# EAGLE design X8-Backplane (EAGLE 7.7.0)
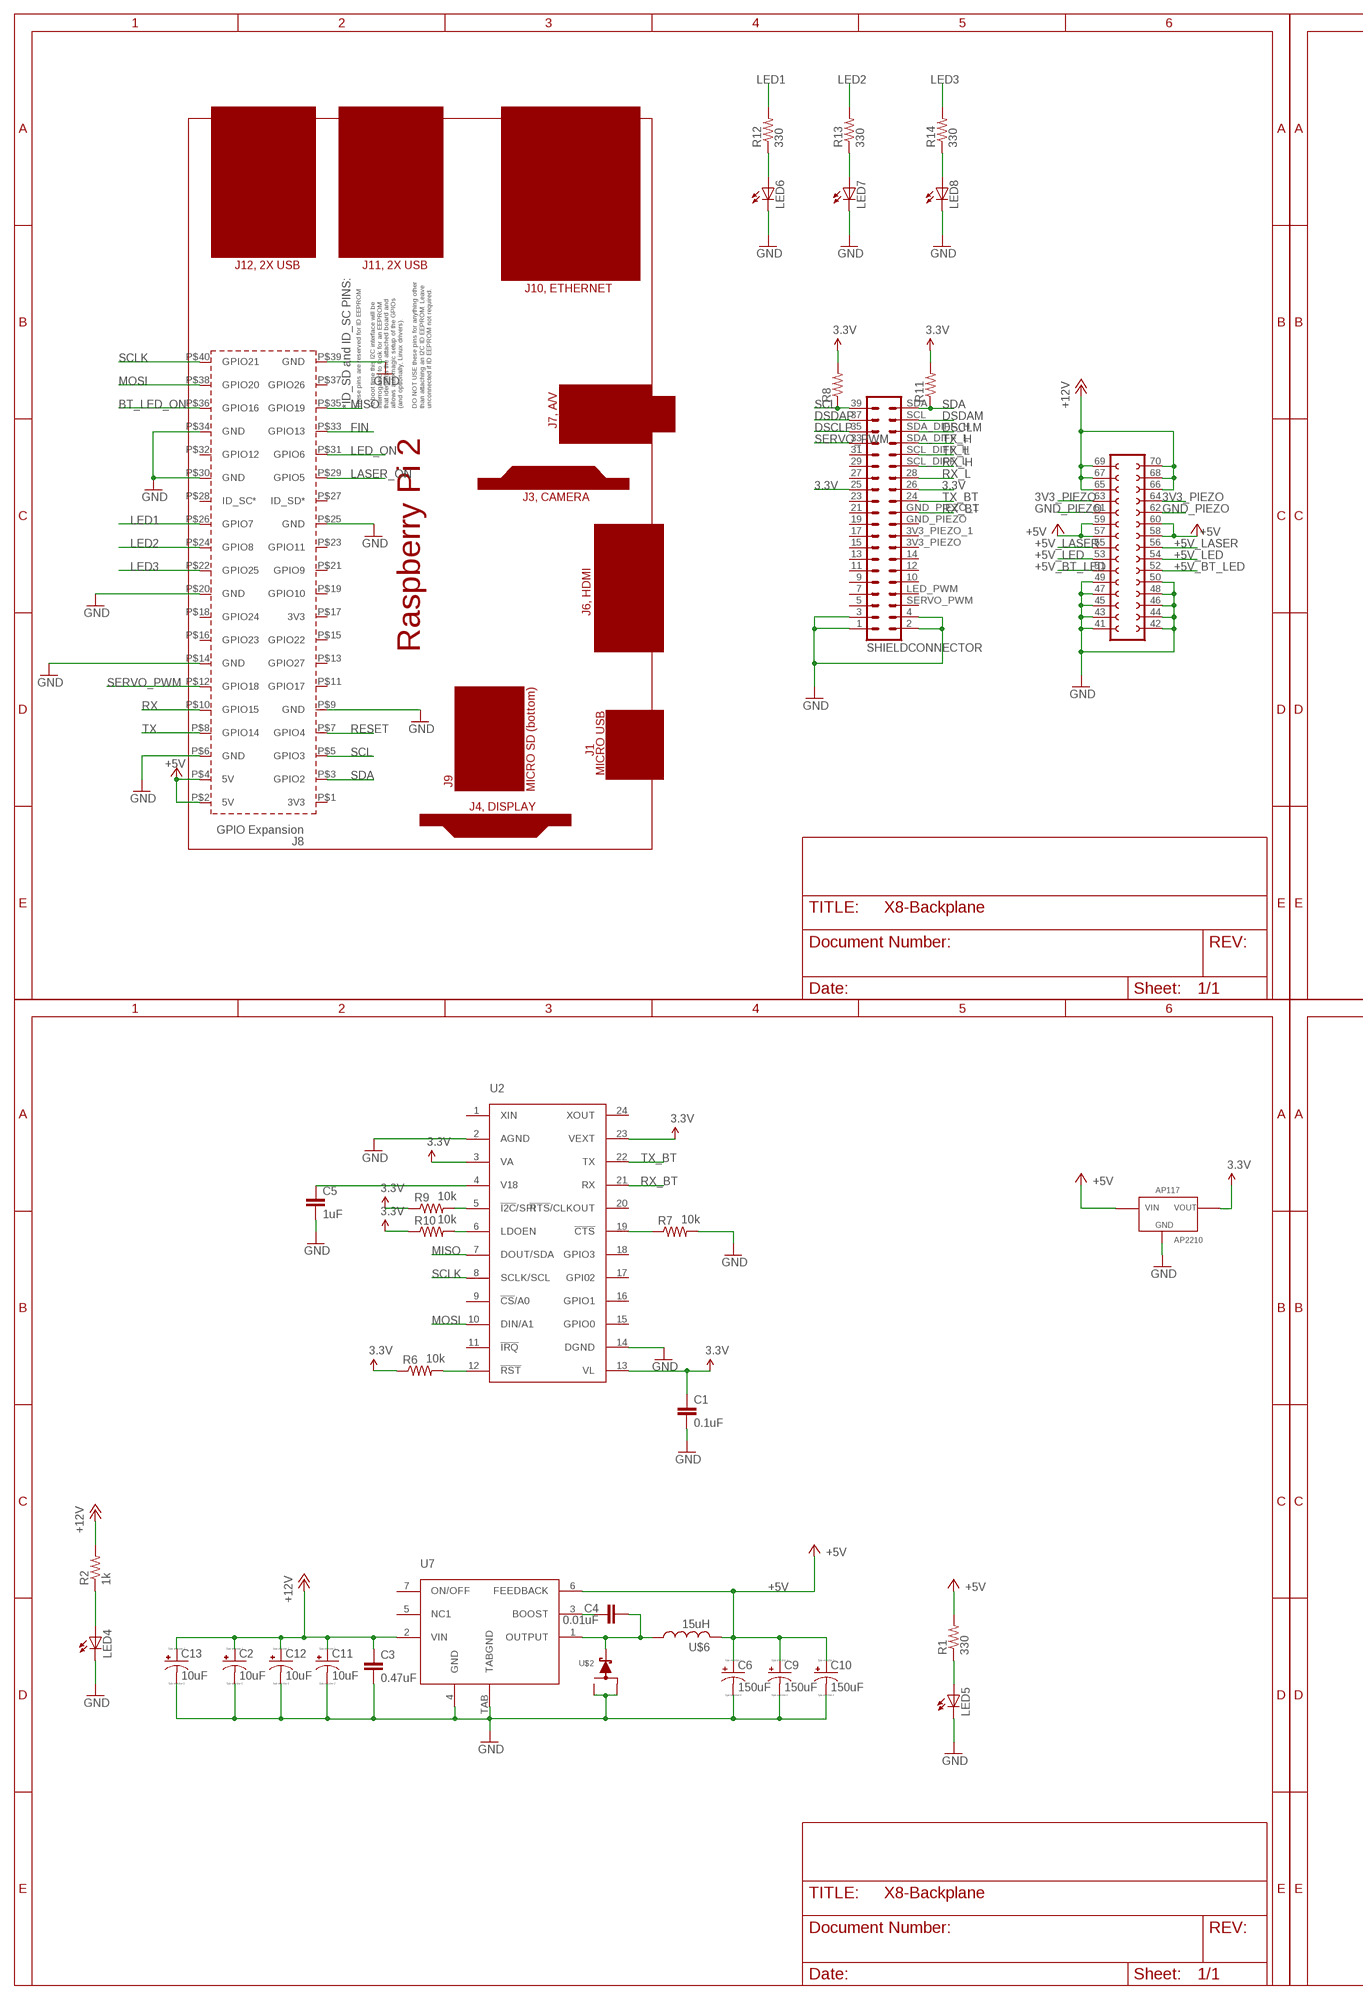
[diagram p0: schematic, sheet 1, part 1 of 2]
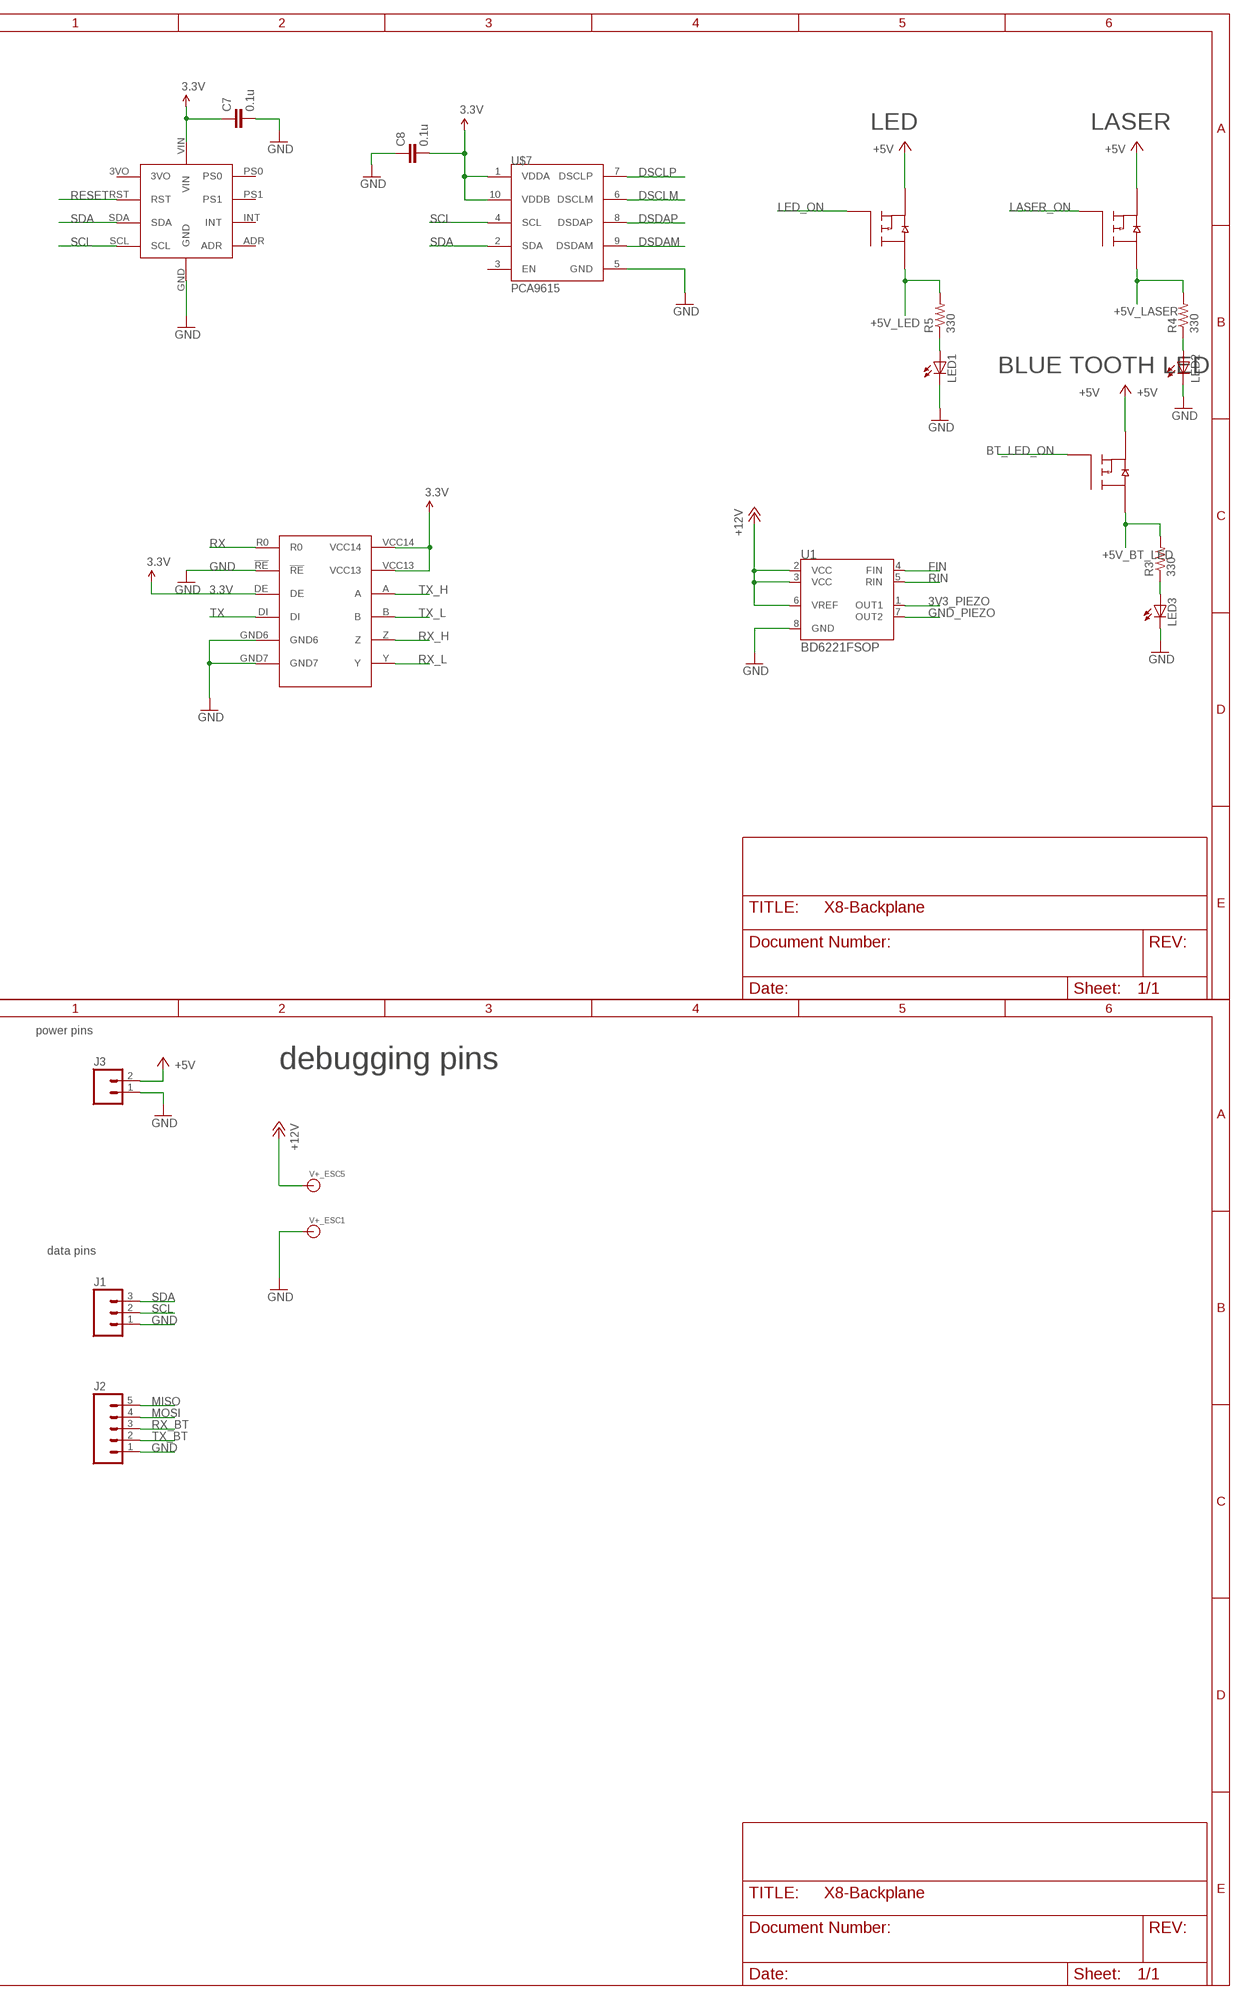
[diagram p1: schematic, sheet 1, part 2 of 2]

## Parts
C1  0.1uF  0.1UF-25V(+80/-20%)(0603)  [0603-CAP]
C2  10uF  C-TANTALUM(10UF_150UF)  [CTAN(7.30_4.30MM)]
C3  0.47uF  0.18UF-0603-10V-10%  [0603]
C4  0.01uF  CAP0603-CAP  [0603-CAP]
C5  1uF  0.1UF-25V(+80/-20%)(0603)  [0603-CAP]
C6  150uF  C-TANTALUM(10UF_150UF)  [CTAN(7.30_4.30MM)]
C7  0.1u  CAP0603-CAP  [0603-CAP]
C8  0.1u  CAP0603-CAP  [0603-CAP]
C9  150uF  C-TANTALUM(10UF_150UF)  [CTAN(7.30_4.30MM)]
C10  150uF  C-TANTALUM(10UF_150UF)  [CTAN(7.30_4.30MM)]
C11  10uF  C-TANTALUM(10UF_150UF)  [CTAN(7.30_4.30MM)]
C12  10uF  C-TANTALUM(10UF_150UF)  [CTAN(7.30_4.30MM)]
C13  10uF  C-TANTALUM(10UF_150UF)  [CTAN(7.30_4.30MM)]
J1  M03PTH  [1X03]
J2  M05PTH  [1X05]
J3  M02PTH  [1X02]
LED1  LEDSML0603  [SML0603]
LED2  LEDSML0603  [SML0603]
LED3  LEDSML0603  [SML0603]
LED4  LEDSML0603  [SML0603]
LED5  LEDSML0603  [SML0603]
LED6  LEDSML0603  [SML0603]
LED7  LEDSML0603  [SML0603]
LED8  LEDSML0603  [SML0603]
PCB1  RPI2  [RPI2]
R1  330  R-US_R0603  [R0603]
R2  1k  R-US_R0603  [R0603]
R3  330  R-US_R0603  [R0603]
R4  330  R-US_R0603  [R0603]
R5  330  R-US_R0603  [R0603]
R6  10k  RESISTOR0603-RES  [0603-RES]
R7  10k  RESISTOR0603-RES  [0603-RES]
R8  RESISTOR0603-RES  [0603-RES]
R9  10k  RESISTOR0603-RES  [0603-RES]
R10  10k  RESISTOR0603-RES  [0603-RES]
R11  RESISTOR0603-RES  [0603-RES]
R12  330  R-US_R0603  [R0603]
R13  330  R-US_R0603  [R0603]
R14  330  R-US_R0603  [R0603]
U1  BD6221FSOP  [SOP8]
U2  MAX3107SSOP  [SSOP-24]
U4  FQB27P06  [TO263-3]
U5  FQB27P06  [TO263-3]
U6  FQB27P06  [TO263-3]
U7  LM2678  [LM2678]
U$1  MAX3491  [MAX3491]
U$2  SWITCHMODE_SCHOTTKY  [DPAK-3]
U$3  BNO055_9DOF_BREAKOUT  [BNO055]
U$4  SHIELDCONNECTOR  [20X2PIN]
U$5  AP2210  [SOT-23-3]
U$6  15uH  HCMA1305  [HCMA1305]
U$7  PCA9615  [MSOP_10]
V+_ESC1  BANANA_CONN  [BANANA_CONN]
V+_ESC5  BANANA_CONN  [BANANA_CONN]

## Nets
3.3V: C1.1 C7.1 C8.2 R6.1 R8.2 R9.1 R10.1 R11.2 U2.3(VA) U2.13(VL) U2.23(VEXT) U$1.DE U$1.VCC13 U$1.VCC14 U$3.VIN U$4.25 U$4.26 U$5.VOUT U$7.1(VDDA) U$7.10(VDDB)
3V3_PIEZO: U1.1(OUT1) U$4.63 U$4.64
+5V: C6.+ C9.+ C10.+ J3.2 PCB1.P$2(5V) PCB1.P$4(5V) R1.2 U4.3(S2) U5.3(S2) U6.3(S2) U7.6(FEEDBACK) U$4.57 U$4.58 U$4.59 U$4.60 U$5.VIN U$6.P$2
+5V_BT_LED: R3.2 U6.TAB(D2) U$4.51 U$4.52
+5V_LASER: R4.2 U5.TAB(D2) U$4.55 U$4.56
+5V_LED: R5.2 U4.TAB(D2) U$4.53 U$4.54
+12V: C2.+ C3.1 C11.+ C12.+ C13.+ R2.2 U1.2(VCC) U1.3(VCC) U1.6(VREF) U7.2(VIN) U$4.65 U$4.66 U$4.67 U$4.68 U$4.69(12V) U$4.70 V+_ESC5.P$1
BT_LED_ON: PCB1.P$36(GPIO16) U6.1(G2)
DSCLM: U$4.SDA_DIFF_H U$7.6(DSCLM)
DSCLP: U$4.35 U$7.7(DSCLP)
DSDAM: U$4.SCL U$7.9(DSDAM)
DSDAP: U$4.37 U$7.8(DSDAP)
FIN: PCB1.P$33(GPIO13) U1.4(FIN)
GND: C1.2 C2.- C3.2 C5.2 C6.- C7.2 C8.1 C9.- C10.- C11.- C12.- C13.- J1.1 J2.1 J3.1 LED1.C LED2.C LED3.C LED4.C LED5.C LED6.C LED7.C LED8.C PCB1.P$6(GND) PCB1.P$9(GND) PCB1.P$14(GND) PCB1.P$20(GND) PCB1.P$25(GND) PCB1.P$30(GND) PCB1.P$34(GND) PCB1.P$39(GND) R7.2 U1.8(GND) U2.2(AGND) U2.14(DGND) U7.4(GND) U7.TAB(TABGND) U$1.!RE U$1.GND6 U$1.GND7 U$2.P$1 U$2.P$3 U$3.GND U$4.1 U$4.2 U$4.3 U$4.4 U$4.41 U$4.42 U$4.43 U$4.44 U$4.45 U$4.46 U$4.47 U$4.48 U$4.49 U$4.50 U$5.GND U$7.5(GND) V+_ESC1.P$1
GND_PIEZO: U1.7(OUT2) U$4.61 U$4.62
LASER_ON: PCB1.P$29(GPIO5) U5.1(G2)
LED1: PCB1.P$26(GPIO7) R12.2
LED2: PCB1.P$24(GPIO8) R13.2
LED3: PCB1.P$22(GPIO25) R14.2
LED_ON: PCB1.P$31(GPIO6) U4.1(G2)
MISO: J2.5 PCB1.P$35(GPIO19) U2.7(DOUT/SDA)
MOSI: J2.4 PCB1.P$38(GPIO20) U2.10(DIN/A1)
N$2: LED5.A R1.1
N$3: LED4.A R2.1
N$4: LED1.A R5.1
N$5: LED2.A R4.1
N$6: LED3.A R3.1
N$7: R6.2 U2.12(!RST!)
N$8: R7.1 U2.19(!CTS!)
N$9: C5.1 U2.4(V18)
N$10: R9.2 U2.5(!I2C!/SPI)
N$12: R10.2 U2.6(LDOEN)
N$13: LED6.A R12.1
N$14: LED7.A R13.1
N$15: LED8.A R14.1
N$18: C4.1 U7.3(BOOST)
N$19: C4.2 U7.1(OUTPUT) U$2.P$4 U$6.P$1
RESET: PCB1.P$7(GPIO4) U$3.RST
RIN: U1.5(RIN)
RX: PCB1.P$10(GPIO15) U$1.R0
RX_BT: J2.3 U2.21(RX) U$4.GND_PIEZO_1
RX_H: U$1.Z U$4.SCL_DIFF_L
RX_L: U$1.Y U$4.28
SCL: J1.2 PCB1.P$5(GPIO3) R8.1 U$3.SCL U$4.39 U$7.4(SCL)
SCLK: PCB1.P$40(GPIO21) U2.8(SCLK/SCL)
SDA: J1.3 PCB1.P$3(GPIO2) R11.1 U$3.SDA U$4.SDA U$7.2(SDA)
SERVO_PWM: PCB1.P$12(GPIO18) U$4.33
TX: PCB1.P$8(GPIO14) U$1.DI
TX_BT: J2.2 U2.22(TX) U$4.24
TX_H: U$1.A U$4.SDA_DIFF_L
TX_L: U$1.B U$4.SCL_DIFF_H
Unconnected: PCB1.P$1(3V3) PCB1.P$11(GPIO17) PCB1.P$13(GPIO27) PCB1.P$15(GPIO22) PCB1.P$16(GPIO23) PCB1.P$17(3V3) PCB1.P$18(GPIO24) PCB1.P$19(GPIO10) PCB1.P$21(GPIO9) PCB1.P$23(GPIO11) PCB1.P$27(ID_SD*) PCB1.P$28(ID_SC*) PCB1.P$32(GPIO12) PCB1.P$37(GPIO26) U2.1(XIN) U2.9(!CS!/A0) U2.11(!IRQ!) U2.15(GPIO0) U2.16(GPIO1) U2.17(GPI02) U2.18(GPIO3) U2.20(!RTS!/CLKOUT) U2.24(XOUT) U7.5(NC1) U7.7(ON/OFF) U$3.3VO U$3.ADR U$3.INT U$3.PS0 U$3.PS1 U$4.3V3_PIEZO U$4.3V3_PIEZO_1 U$4.5 U$4.7 U$4.9 U$4.10 U$4.11 U$4.12 U$4.13 U$4.14 U$4.15 U$4.17 U$4.19 U$4.21 U$4.23 U$4.27 U$4.29 U$4.31 U$4.GND_PIEZO U$4.LED_PWM U$4.SERVO_PWM U$7.3(EN)

## Notes on the sheet
- LED | LASER
- BLUE TOOTH LED
- power pins
- debugging pins
- data pins

## Library data of the parts
C1 = SparkFun-Capacitors:0.1UF-25V(+80/-20%)(0603): CAP-00810 Ceramic Standard decoupling cap; PROD_ID: CAP-00810
C2 C6 C9-C13 = PowerComponents:C-TANTALUM(10UF_150UF)
C3 = SparkFun-Capacitors:0.18UF: 0.18µF ceramic capacitor A capacitor is a passive two-terminal electrical component used to store electrical energy temporarily in an electric field.; PROD_ID: CAP-12380; VALUE: 0.18uF
C4 C7 C8 = SparkFun-Passives:CAP: Capacitor Standard 0603 ceramic capacitor, and 0.1" leaded capacitor.
C5 = SparkFun-Capacitors:0.1UF-25V(+80/-20%)(0603): CAP-00810 Ceramic Standard decoupling cap; PROD_ID: CAP-00810; VALUE: 0.1uF
J1 = SparkFun-Connectors:M03: Header 3 Standard 3-pin 0.1" header. Use with straight break away headers (SKU : PRT-00116), right angle break away headers (PRT-00553), swiss pins (PRT-00743), machine pins (PRT-00117), and female headers (PRT-00115). Molex polarized connector foot print use with SKU : PRT-08232 with associated crimp pins and housings.
J2 = SparkFun-Connectors:M05: Header 5 Standard 5-pin 0.1" header. Use with straight break away headers (SKU : PRT-00116), right angle break away headers (PRT-00553), swiss pins (PRT-00743), machine pins (PRT-00117), and female headers (PRT-00115). Molex polarized connector foot print use with SKU : PRT-08230 with associated crimp pins and housings.
J3 = SparkFun-Connectors:M02: Standard 2-pin 0.1" header. Use with - straight break away headers ( PRT-00116) - right angle break away headers (PRT-00553) - swiss pins (PRT-00743) - machine pins (PRT-00117) - female headers (PRT-00115) Molex polarized connector foot print use with: PRT-08233 with associated crimp pins and housings. 2.54_SCREWTERM for use with PRT-10571. 3.5mm Screw Terminal footprints for PRT-08084 5mm Screw Terminal footprints for use with PRT-08432
LED1-LED8 = led:LED: LED OSRAM: - CHIPLED LG R971, LG N971, LY N971, LG Q971, LY Q971, LO R971, LY R971 LH N974, LH R974 LS Q976, LO Q976, LY Q976 LO Q996 - Hyper CHIPLED LW Q18S LB Q993, LB Q99A, LB R99A - SideLED LS A670, LO A670, LY A670, LG A670, LP A670 LB A673, LV A673, LT A673, LW A673 LH A674 LY A675 LS A676, LA A676, LO A676, LY A676, LW A676 LS A679, LY A679, LG A679 - Hyper Micro SIDELED® LS Y876, LA Y876, LO Y876, LY Y876 LT Y87S - SmartLED LW L88C, LW L88S LB L89C, LB L89S, LG L890 LS L89K, LO L89K, LY L89K LS L896, LA L896, LO L896, LY L896 - TOPLED LS T670, LO T670, LY T670, LG T670, LP T670 LSG T670, LSP T670, LSY T670, LOP T670, LYG T670 LG T671, LOG T671, LSG T671 LB T673, LV T673, LT T673, LW T673 LH T674 LS T676, LA T676, LO T676, LY T676, LB T676, LH T676, LSB T676, LW T676 LB T67C, LV T67C, LT T67C, LS T67K, LO T67K, LY T67K, LW E67C LS E67B, LA E67B, LO E67B, LY E67B, LB E67C, LV E67C, LT E67C LW T67C LS T679, LY T679, LG T679 LS T770, LO T770, LY T770, LG T770, LP T770 LB T773, LV T773, LT T773, LW T773 LH T774 LS E675, LA E675, LY E675, LS T675 LS T776, LA T776, LO T776, LY T776, LB T776 LHGB T686 LT T68C, LB T68C - Hyper Mini TOPLED® LB M676 - Mini TOPLED Santana® LG M470 LS M47K, LO M47K, LY M47K Source: http://www.osram.convergy.de LUXEON: - LUMILED® LXK2-PW12-R00, LXK2-PW12-S00, LXK2-PW14-U00, LXK2-PW14-V00 LXK2-PM12-R00, LXK2-PM12-S00, LXK2-PM14-U00 LXK2-PE12-Q00, LXK2-PE12-R00, LXK2-PE12-S00, LXK2-PE14-T00, LXK2-PE14-U00 LXK2-PB12-K00, LXK2-PB12-L00, LXK2-PB12-M00, LXK2-PB14-N00, LXK2-PB14-P00, LXK2-PB14-Q00 LXK2-PR12-L00, LXK2-PR12-M00, LXK2-PR14-Q00, LXK2-PR14-R00 LXK2-PD12-Q00, LXK2-PD12-R00, LXK2-PD12-S00 LXK2-PH12-R00, LXK2-PH12-S00 LXK2-PL12-P00, LXK2-PL12-Q00, LXK2-PL12-R00 Source: www.luxeon.com KINGBRIGHT: KA-3528ASYC Source: www.kingbright.com
PCB1 = MicrocontrollerComponents:RPI2: Device for Raspberry Pi 2 board created by www.element14.com More information and support community is available at http://www.element14.com/community/community/raspberry-pi/raspberrypi2
R1-R5 R12-R14 = resistor:R-US_: RESISTOR, American symbol
R6-R11 = SparkFun-Passives:RESISTOR: Resistor Basic schematic elements and footprints for 0603, 1206, and PTH resistors.
U1 = CamSensComponents:BD6221F: H-bridge driver (full bridge driver) for brush motor applications
U2 = BackplaneParts:MAX3107: MAX3107 SPI/I2C UART with 128-Word FIFOs Digi-Key part: http://www.digikey.com/product-detail/en/maxim-integrated/MAX3107EAG-/MAX3107EAG--ND/2238939
U4-U6 = CamSensComponents:FQB27P06
U7 = PowerComponents:LM2678: LM2678 Buck Converter IC 12V-to-5V
U$1 = BackplaneParts:MAX3491
U$2 = PowerComponents:SWITCHMODE_SCHOTTKY: {Digi-Key Part Number: MBRD835LT4GOSCT-ND} {Voltage - DC Reverse (Vr) (Max): 35V} {Current - Average Rectified (Io): 8A} {Voltage - Forward (Vf) (Max) @ If: 510mV @ 8A} {Speed: Fast Recovery =< 500ns, > 200mA (Io)} {Current - Reverse Leakage @ Vr: 1.4mA @ 35V} {Mounting Type: Surface Mount} {Package / Case: TO-252-3, DPak (2 Leads + Tab), SC-63} {Supplier Device Package: DPAK-3} {Operating Temperature - Junction: -65°C ~ 150°C}
U$3 = Other:BNO055_9DOF_BREAKOUT
U$4 = backplane_to_shield_connector:SHIELDCONNECTOR
U$5 = PowerComponents:AP2210
U$6 = DiscreteComponents:HCMA1305
U$7 = test_lib:PCA9615
V+_ESC1 V+_ESC5 = SparkFun-Connectors:BANANA_CONN: Through-hole banana jack

## Board
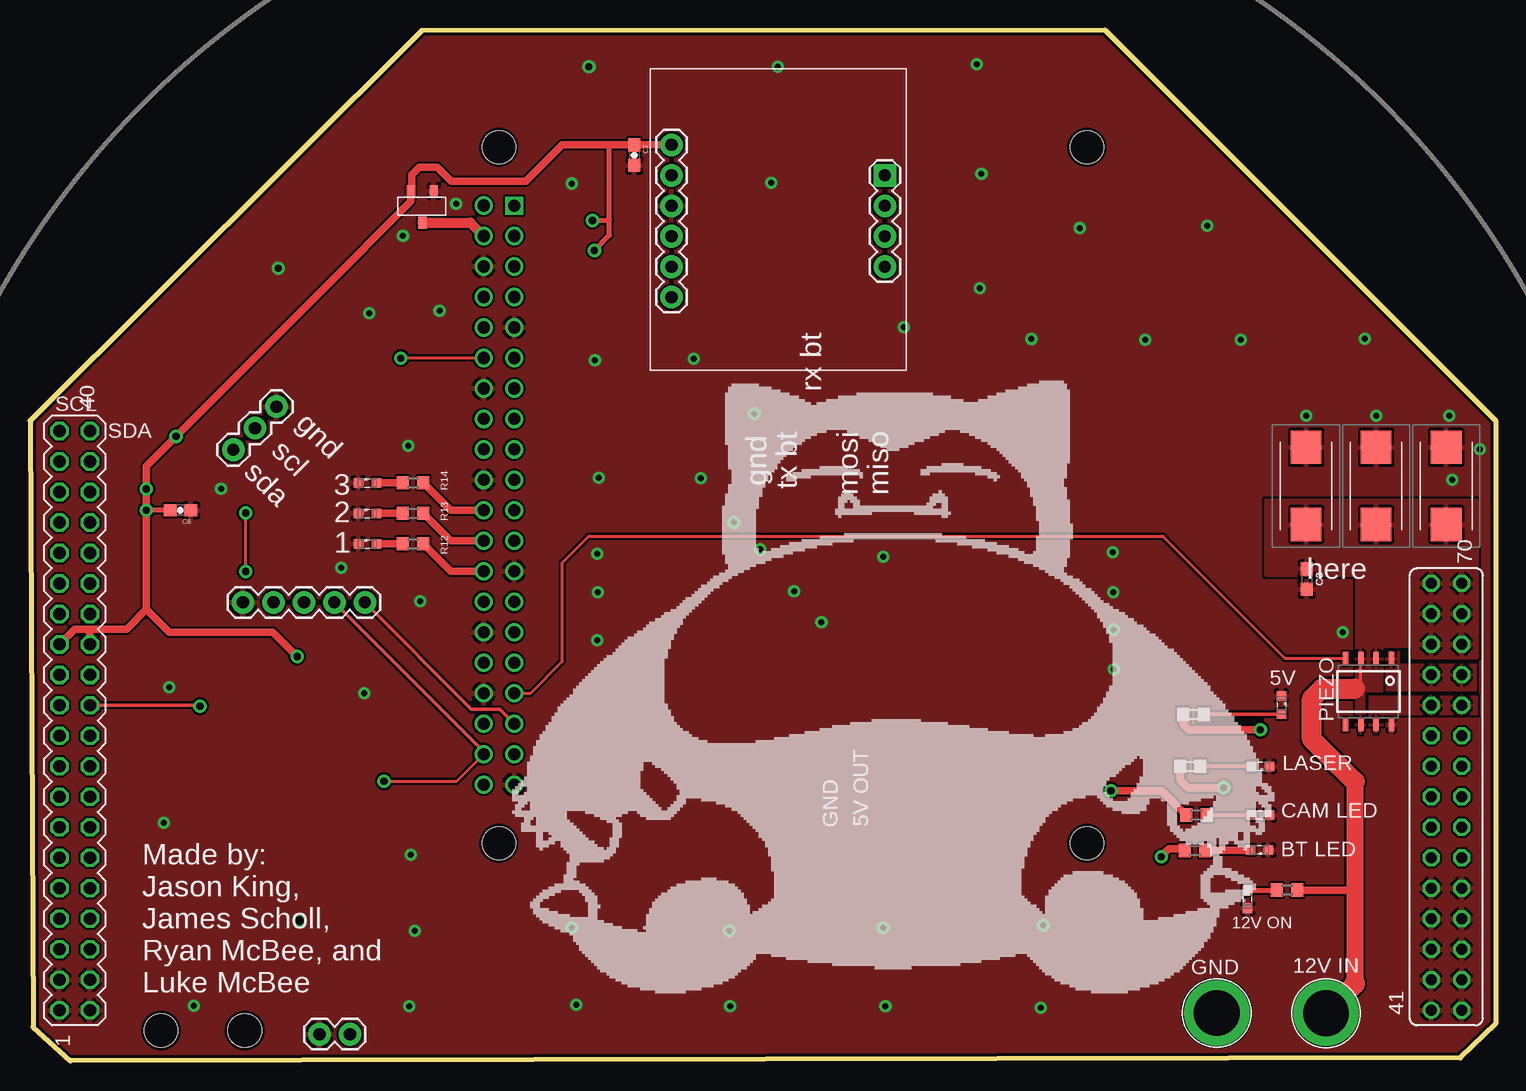
[diagram p2: board, top side]
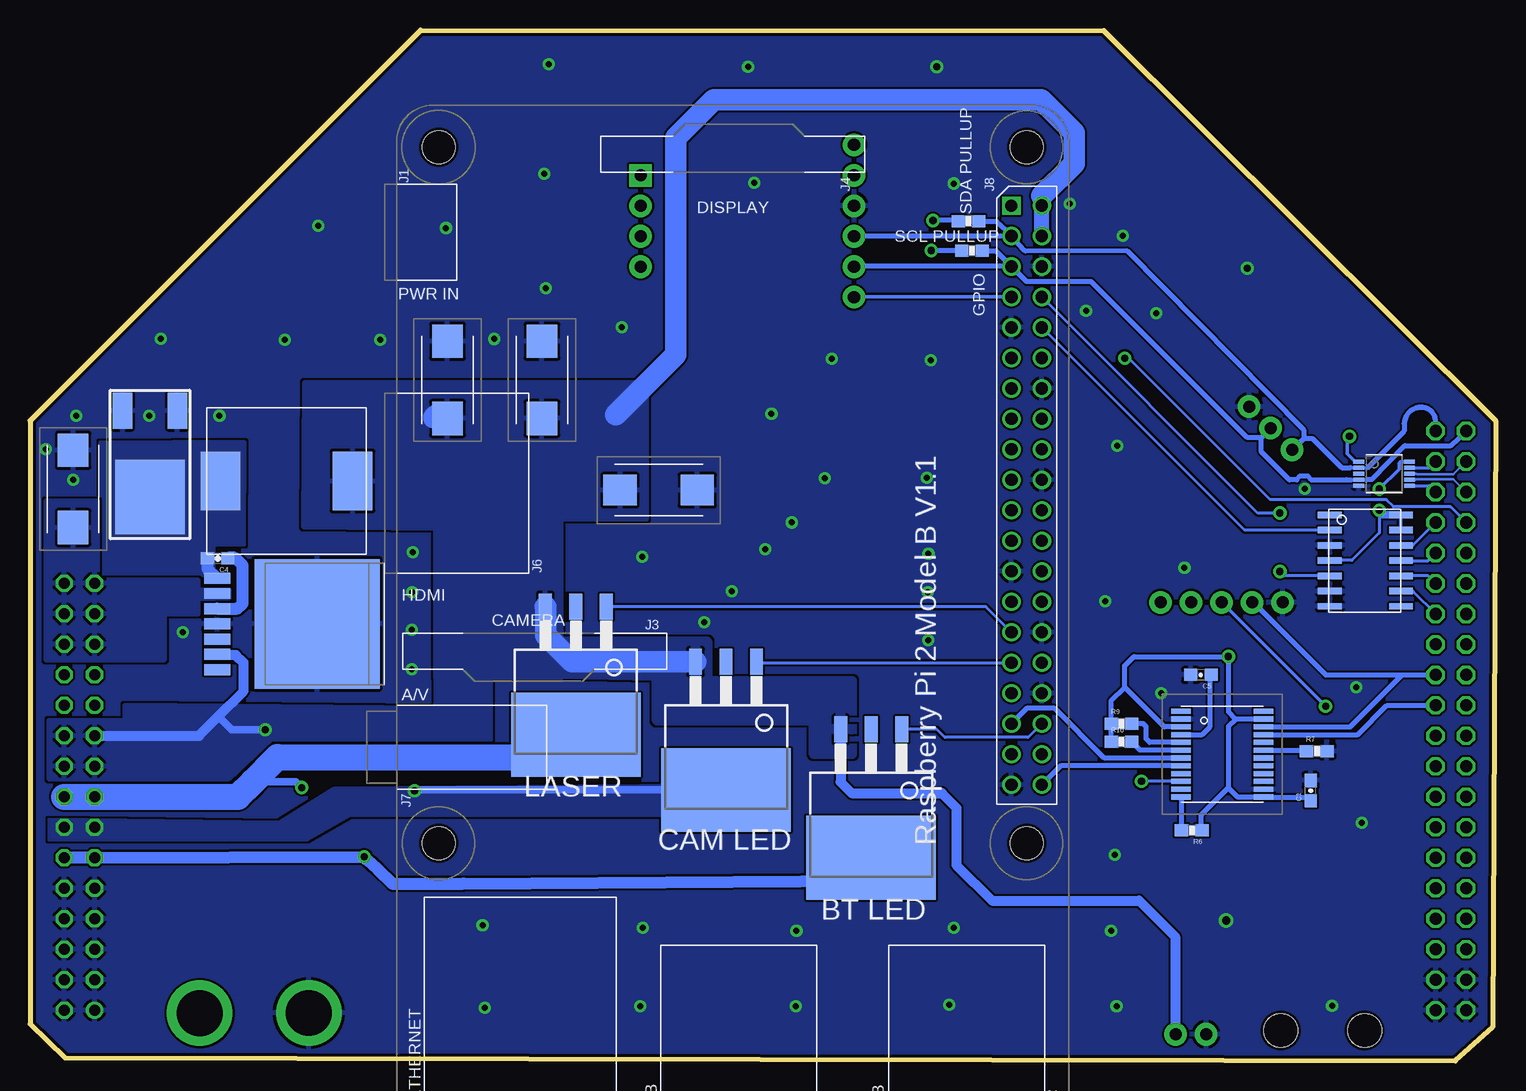
[diagram p3: board, bottom side, seen from below]

Size 122.13 x 85.9 mm. Coordinates in mm from the lower left corner, seen from the top.
Outline: 32.64,85.85 0,53.36 0.25,2.82 3.36,0 119.21,0.25 122.13,3.07 122.13,53.36 89.59,85.9 32.64,85.85
Copper layers (1*16): Top 0.035mm / dielectric 1.5mm / Bottom 0.035mm
Design rules "GoldPhoenix": minimum track width 7mil, minimum drill 10mil, track to track 7mil, track to pad 7mil, pad to pad 7mil, via to via 7mil, smd to smd 7mil, copper to edge 10mil, drill to drill 8mil, minimum pad ring 10mil, minimum via ring 10mil, stop-mask expansion 4mil, vias tented up to drill 25mil, thermal gap 10mil
Holes 2.8 mm at 17.9,2.52 10.91,2.52

### Footprints (pad centres in the part's own frame; a part is rotated, then mirrored left to right if it is on the bottom)
0603-CAP = smd 1.1 x 1: 1 -0.85,0; 2 0.85,0
CTAN(7.30_4.30MM) = smd 2.77 x 2.55: + -3.22,0; - 3.22,0
0603 = smd 1.1 x 1: 1 -0.85,0; 2 0.85,0
1X03 = drill 1.016 pad 1.88: 1 0,0; 2 2.54,0; 3 5.08,0
1X05 = drill 1.016 pad 1.88: 1 0,0; 2 2.54,0; 3 5.08,0; 4 7.62,0; 5 10.16,0
1X02 = drill 1.016 pad 1.88: 1 0,0; 2 2.54,0
SML0603 = smd 0.8 x 0.8: A 0.75,0; C -0.75,0
RPI2 = drill 1.016 square: P$1 8.37,51.23 | drill 1.016: P$2 8.357,53.772; P$3 10.897,51.232; P$4 10.897,53.772; P$5 13.437,51.232; P$6 13.437,53.772; P$7 15.977,51.232; P$8 15.977,53.772; P$9 18.517,51.232; P$10 18.517,53.772; P$11 21.057,51.232; P$12 21.057,53.772; P$13 23.597,51.232; P$14 23.597,53.772; P$15 26.137,51.232; P$16 26.137,53.772; P$17 28.677,51.232; P$18 28.677,53.772; P$19 31.217,51.232; P$20 31.217,53.772; P$21 33.757,51.232; P$22 33.757,53.772; P$23 36.297,51.232; P$24 36.297,53.772; P$25 38.837,51.232; P$26 38.837,53.772; P$27 41.377,51.232; P$28 41.377,53.772; P$29 43.917,51.232; P$30 43.917,53.772; P$31 46.457,51.232; P$32 46.457,53.772; P$33 48.997,51.232; P$34 48.997,53.772; P$35 51.537,51.232; P$36 51.537,53.772; P$37 54.077,51.232; P$38 54.077,53.772; P$39 56.617,51.232; P$40 56.617,53.772 | hole 2.75: 3.5,3.5; 61.5,3.5; 3.5,52.5; 61.5,52.5
R0603 = smd 1 x 1.1: 1 -0.85,0; 2 0.85,0
0603-RES = smd 1.1 x 1: 1 -0.85,0; 2 0.85,0
SOP8 = smd 0.462 x 1.1: 1 0.595,-0.55; 2 1.865,-0.55; 3 3.135,-0.55; 4 4.405,-0.55; 5 4.405,4.95; 6 3.135,4.95; 7 1.865,4.95; 8 0.595,4.95
SSOP-24 = smd 1.62 x 0.42: 1 -3.425,3.575; 2 -3.425,2.925; 3 -3.425,2.275; 4 -3.425,1.625; 5 -3.425,0.975; 6 -3.425,0.325; 7 -3.425,-0.325; 8 -3.425,-0.975; 9 -3.425,-1.625; 10 -3.425,-2.275; 11 -3.425,-2.925; 12 -3.425,-3.575; 13 3.425,-3.575; 14 3.425,-2.925; 15 3.425,-2.275; 16 3.425,-1.625; 17 3.425,-0.975; 18 3.425,-0.325; 19 3.425,0.325; 20 3.425,0.975; 21 3.425,1.625; 22 3.425,2.275; 23 3.425,2.925; 24 3.425,3.575
TO263-3 = smd 1.067 x 2.159: 1 -2.54,-5.08; 2 0,-5.08; 3 2.54,-5.08 | smd 10.795 x 6.985: TAB 0,5.601
LM2678 = smd 2.159 x 0.914: 1 8.331,-3.81; 2 8.331,-2.54; 3 8.331,-1.27; 4 8.331,0; 5 8.331,1.27; 6 8.331,2.54; 7 8.331,3.81 | smd 10.414 x 10.795: TAB 0,0
MAX3491 = smd 1.981 x 0.533: !RE 0,5.08; A 5.918,5.08; B 5.918,3.81; DE 0,3.81; DI 0,2.54; GND6 0,1.27; GND7 0,0; NC1 0,7.62; NC8 5.918,0; R0 0,6.35; VCC13 5.918,6.35; VCC14 5.918,7.62; Y 5.918,1.27; Z 5.918,2.54
DPAK-3 = smd 3 x 1.6: P$1 4.08,-2.285; P$3 4.08,2.285 | smd 6.2 x 5.8: P$4 -3.1,0
BNO055 = drill 1.016 pad 1.88: 3VO -8.89,2.54; ADR 8.89,-5.08; GND -8.89,0; INT 8.89,-2.54; PS1 8.89,0; RST -8.89,-7.62; SCL -8.89,-5.08; SDA -8.89,-2.54; VIN -8.89,5.08 | drill 1.016 pad 1.88 square: PS0 8.89,2.54
20X2PIN = drill 1.016 octagon: 1 -55.88,-26.67; 2 -53.34,-26.67; 3 -55.88,-24.13; 3V3_PIEZO -53.34,-8.89; 3V3_PIEZO_1 -53.34,-6.35; 4 -53.34,-24.13; 5 -55.88,-21.59; 7 -55.88,-19.05; 9 -55.88,-16.51; 10 -53.34,-16.51; 11 -55.88,-13.97; 12 -53.34,-13.97; 13 -55.88,-11.43; 14 -53.34,-11.43; 15 -55.88,-8.89; 17 -55.88,-6.35; 19 -55.88,-3.81; 21 -55.88,-1.27; 23 -55.88,1.27; 24 -53.34,1.27; 25 -55.88,3.81; 26 -53.34,3.81; 27 -55.88,6.35; 28 -53.34,6.35; 29 -55.88,8.89; 31 -55.88,11.43; 33 -55.88,13.97; 35 -55.88,16.51; 37 -55.88,19.05; 39 -55.88,21.59; GND_PIEZO -53.34,-3.81; GND_PIEZO_1 -53.34,-1.27; LED_PWM -53.34,-19.05; SCL -53.34,19.05; SCL_DIFF_H -53.34,11.43; SCL_DIFF_L -53.34,8.89; SDA -53.34,21.59; SDA_DIFF_H -53.34,16.51; SDA_DIFF_L -53.34,13.97; SERVO_PWM -53.34,-21.59 | drill 0.914: 41 58.42,-26.67 | drill 0.914 octagon: 42 60.96,-26.67; 43 58.42,-24.13; 44 60.96,-24.13; 45 58.42,-21.59; 46 60.96,-21.59; 47 58.42,-19.05; 48 60.96,-19.05; 49 58.42,-16.51; 50 60.96,-16.51; 51 58.42,-13.97; 52 60.96,-13.97; 53 58.42,-11.43; 54 60.96,-11.43; 55 58.42,-8.89; 56 60.96,-8.89; 57 58.42,-6.35; 58 60.96,-6.35; 59 58.42,-3.81; 60 60.96,-3.81; 61 58.42,-1.27; 62 60.96,-1.27; 63 58.42,1.27; 64 60.96,1.27; 65 58.42,3.81; 66 60.96,3.81; 67 58.42,6.35; 68 60.96,6.35; 69 58.42,8.89; 70 60.96,8.89
SOT-23-3 = smd 0.7 x 1: GND 0,0; VIN 0.95,2.6; VOUT 1.9,0
HCMA1305 = smd 4.9 x 3.3: P$1 0,5.5; P$2 0,-5.5
MSOP_10 = smd 0.305 x 0.889: 1 -1,-2.11; 2 -0.5,-2.11; 3 0,-2.11; 4 0.5,-2.11; 5 1,-2.11; 6 1,2.11; 7 0.5,2.11; 8 0,2.11; 9 -0.5,2.11; 10 -1,2.11
BANANA_CONN = drill 3.81 pad 5.461: P$1 0,0

### Placement (x,y rotation side)
C1  15.41,22.51 90 bottom
C2  118.53,47.66 90 bottom
C3  106.39,40.14 270 top
C4  106.49,41.87 180 bottom
C5  24.55,32.16 180 bottom
C6  87.34,56.75 90 bottom
C7  50.36,75.47 270 top
C8  12.54,45.88 180 top
C9  69.74,47.56 0 bottom
C10  79.47,56.75 90 bottom
C11  112.18,47.91 90 top
C12  118.02,47.91 90 top
C13  106.34,47.91 90 top
J1  20.54,54.52 225 top
J2  17.75,38.21 0 top
J3  24.12,2.22 0 top
LED1  102.53,20.48 180 top
LED2  102.53,24.54 180 top
LED3  102.45,17.56 180 top
LED4  101.46,13.47 90 top
LED5  104.28,29.65 270 top
LED6  28.11,43.09 0 top
LED7  28.11,45.63 0 top
LED8  28.11,48.17 0 top
PCB1  91.58,79.63 270 bottom
R1  96.94,28.86 180 top
R2  104.77,14.23 0 top
R3  97.1,17.53 180 top
R4  96.69,24.54 180 top
R5  97.2,20.48 180 top
R6  25.31,19.21 180 bottom
R7  14.9,25.81 0 bottom
R8  43.63,67.5 180 bottom
R9  31.16,28.1 0 bottom
R10  31.16,26.58 0 bottom
R11  43.91,69.98 180 bottom
R12  31.92,43.09 0 top
R13  31.92,45.63 0 top
R14  31.92,48.17 0 top
U1  114.04,32.98 180 top
U2  22.77,25.56 0 bottom
U4  64.13,28.18 180 bottom
U5  76.65,32.77 180 bottom
U6  52.04,22.54 180 bottom
U7  98.21,36.41 180 bottom
U$1  13.81,37.88 0 bottom
U$2  112.13,50.1 90 bottom
U$3  62.35,71.25 0 top
U$4  58.33,30.89 0 top
U$5  33.65,72.45 180 top
U$6  100.75,48.32 90 bottom
U$7  9.29,48.93 270 bottom
V+_ESC1  98.9,4 0 top
V+_ESC5  107.99,3.97 90 top

### Tracks (layer width: path | path; a pad name or v marks a point on that pad's centre or on a via)
3.3V  (via drill 0.6, 0.6 pad 0.3)
  Top 0.305: 27.09,66.96 27.85,67.72 | 29.16,69.03 28.12,67.99
  Top 0.406: v47.03,67.52 48.28,68.79 48.28,70.04 | 48.28,70.04 48.28,76.34 | v46.88,70.04 48.28,70.04 | C8.2 v9.69,45.88
  Top 0.61: 9.69,37.63 v9.69,45.88 v9.69,47.66 9.69,49.56 v12.17,52.04 27.85,67.72 28.12,67.99 31.75,71.62 U$5.VOUT 31.79,72.49 31.79,73.82 32.43,74.46 33.95,74.46 35.09,73.31 41.32,73.31 44.34,76.34 48.28,76.34 50.35,76.34 | 9.69,37.63 8.04,35.97 5.15,35.97 | 5.15,35.97 3.72,35.97 U$4.25 | 9.69,37.63 11.6,35.72 20.23,35.72 v22.27,33.69 | U$4.26 4.99,35.82 5.15,35.97 | 50.35,76.34 C7.1 | 50.35,76.34 U$3.VIN
  Bottom 0.254: 9.69,45.75 9.69,44 11.98,41.71 13.78,41.71 U$1.DE
  Bottom 0.305: U$7.1 11.71,49.93 12.36,50.58 12.36,51.85 v12.17,52.04 | U$1.VCC13 U$1.VCC14 | U$7.10 7.93,49.93 8.04,49.82 8.04,49.31 v9.69,47.66 | R11.2 44.66,70.04
  Bottom 0.406: U2.13 15.73,21.99 C1.1 | U2.13 19.24,21.99 19.22,22 | R10.1 R9.1 32.01,30.04 30.9,31.15 | 22.27,22.77 22.27,27.85 21.63,28.49 U2.23 21.64,28.49 22.27,29.12 v22.27,33.69 30.14,33.69 30.9,32.93 30.9,31.15 | U2.13 21.49,21.99 22.27,22.77 | 22.27,22.77 24.55,20.48 24.55,19.3 R6.1 | U2.3 27.59,27.84 30.9,31.15 | R8.2 v47.03,67.52 | 44.66,70.04 v46.88,70.04
  Bottom 0.61: v9.69,45.88 9.69,45.75 9.44,45.5 U$1.VCC14
3V3_PIEZO
  pour Top: 113.1,34.07 114.04,34.07 114.04,33.03 120.44,33.03 120.44,30.89 113.1,30.89
+5V  (via drill 0.6)
  Top 0.61: v102.53,27.59 96.54,27.59 96.09,28.04 R1.2
  Top 0.813: U$5.VIN 36.69,69.85 PCB1.P$4
  Bottom 0.61: v102.53,27.59 105.32,27.59 106.44,28.71
  Bottom 0.813: U$4.59 108.07,27.08 106.44,28.71 104.33,30.82 104.33,33.18 104.97,33.82 106.49,33.82 U7.6 | U6.3 54.58,23.22 53.66,22.31 46.14,22.31 44.92,21.09 44.92,16.31 41.95,13.34 29.71,13.34 26.71,10.35 26.71,2.27 J3.2
  Bottom 1.27: PCB1.P$4 PCB1.P$2
  Bottom 1.422: PCB1.P$2 37.81,72.07
  Bottom 1.778: 88.23,53.84 88.48,53.58 | U4.3 76.95,33.26 79.16,35.47 79.16,37.83 U5.3 | 37.81,72.07 35.12,74.76 35.12,77.35 37.86,80.09 65.17,80.09 68.32,76.94 68.32,58.84 73.32,53.84
  pour Bottom: 53.64,31.66 53.64,25.56 56.81,25.56 56.81,28.35 69.89,28.35 69.89,32.04 81.96,32.29 81.91,34.96 65.7,34.96 65.7,31.66
  pour Bottom: 120.56,23.53 105.58,23.53 102.02,26.83 83.73,26.83 83.73,35.21 88.31,35.21 88.31,29.37 114.21,29.62 114.21,28.35 120.56,28.35
  pour Bottom: 70.78,56.55 70.78,45.12 77.89,45.12 77.89,31.91 88.31,31.91 88.31,44.36 99.31,44.48 99.23,56.55
+5V_BT_LED  (via drill 0.6)
  Top 0.61: v94.28,17 arc-45 94.31,17.09 94.91,17.69 95.99,17.69 arc-45 96.17,17.61 R3.2
  Bottom 0.254: v94.28,17 94.19,17 94.19,16.9
  Bottom 0.61: 92.04,14.89 91.89,14.74
  Bottom 1.016: U$4.52 U$4.51 94.33,17.03 94.19,16.9 94.02,16.75 93.21,16.02 91.89,14.74 86.02,14.78 52.29,14.99 U6.TAB
+5V_LASER  (via drill 0.6)
  Top 0.61: v99.48,22.77 96.46,22.77 95.85,23.38 95.85,24.53 R4.2
  Bottom 0.61: v99.48,22.77 99.99,23.27 103.55,23.27
  Bottom 2.184: U$4.56 U$4.55 104.82,22 103.55,23.27 101.51,25.31 77.38,25.31 75.86,26.83 76.31,26.83 U5.TAB
+5V_LED  (via drill 0.6)
  Top 0.61: R5.2 94.31,22.51 v90.08,22.51
  Bottom 0.61: v90.08,22.51 90.02,22.58 U4.TAB
  pour Bottom (no thermals): 120.51,20.18 101.34,19.92 96.77,22.74 66.23,22.99 66.23,20.43 95.5,20.43 99.05,18.37 120.51,18.37
+12V
  Top 0.254: 110.4,31.02 110.4,31.3 110.89,31.78 110.89,33.51 U1.3
  Top 0.61: R2.2 110.2,14.23 arc-45 110.38,14.16
  Top 1.422: 110.4,23.27 110.38,23.27 110.38,14.16 110.4,14.16 110.4,6.49
  Top 1.676: 110.4,31.02 107.66,31.02 106.82,30.18 106.82,26.81 109.03,24.6 arc-45 109.12,24.56 110.4,23.27 | 110.4,6.49 arc-45 110.33,6.31 V+_ESC5.P$1
  pour Top (rank 2): 111.17,30.84 112.69,30.84 112.69,34.55 115.51,34.55 115.51,33.87 120.49,33.87 120.49,40.77 110.51,40.77 110.51,27.34 111.17,27.34
  pour Bottom (rank 2): 120.82,33.43 110.91,33.43 110.91,37.24 108.12,37.24 108.12,40.04 116.5,40.04 116.5,46.64 120.82,46.64
  pour Bottom (no thermals): 105.58,39.28 105.58,38.51 110.15,38.51 110.15,39.28
  pour Top: 103.04,46.64 103.04,40.55 115.23,40.55 115.23,33.69 120.56,33.69 120.56,46.64
BT_LED_ON
  Bottom 0.254: PCB1.P$36 38.94,26.96 45.89,26.96 46.55,27.62 U6.1
DSCLM
  Bottom 0.254: U$7.6 5.52,47.93 U$4.SDA_DIFF_H
DSCLP
  Bottom 0.229: 6.69,48.43 6.62,48.47 3.55,48.47 U$4.35
  Bottom 0.254: U$7.7 6.69,48.43
DSDAM
  Bottom 0.254: U$7.9 5.51,49.43 U$4.SCL
DSDAP
  Bottom 0.229: U$7.8 6.62,48.93 6.54,48.88 3.55,48.88 U$4.37
FIN
  Top 0.254: U1.4 109.6,33.56 104.56,33.56 94.4,43.72 46.57,43.72 44.36,41.51 44.36,33.28 41.72,30.64 PCB1.P$33
GND  (via drill 0.5, 0.6 pad 0.3, 0.7)
  other vias: 15.92,47.66 13.63,4.58 32.05,10.83 45.53,4.68 58.33,4.55 71.29,4.55 84.24,4.43 11.6,31.15 11.14,19.85 109.39,35.72 47.26,42.25 98.11,69.6 79.29,73.92 78.91,83.07 62.3,82.84 46.57,82.84 47.08,58.38 60.85,42.63 72.81,61.12 79.14,64.37 83.46,60.15 87.47,69.4 92.93,60.08 100.91,60.08 106.34,53.75 112.18,53.75 118.28,53.75 120.82,50.96 118.53,48.42 111.24,60.18 27.85,30.64 35.5,71.43 45.15,73.11 31.08,68.77 31.51,51.26 25.92,41.1 32.53,38.31 28.26,62.29 34.13,62.52 90.26,39.05 90.24,42.37 90.31,35.92 90.31,32.65 20.69,66.05 45.15,11.08 58.26,10.85 71.09,11.08 84.42,11.29 31.59,4.55 31.74,17.18 22.44,11.69 47.39,48.6 55.9,48.55 60.34,53.93 47.29,35.06 65.95,36.53 61.76,73.16 55.31,58.5 63.67,39.15 71.11,42.02 47.31,39.05 58.67,44.86
  pour Bottom (rank 6): 34.2,92.01 33.93,93.91 -2.35,55.74 -2.8,0.41 18.48,-20.87 103.8,-20.87 124.22,1.71 124.83,52.84 87.7,91.68 35.86,91.98
  pour Top (rank 6): 33.01,90.79 29.76,90.79 -3.36,53.78 -2.5,-0.83 17.72,-12.08 103.04,-12.08 126.79,0.57 128.16,51.8 88,90.43 36.16,90.74
GND_PIEZO
  pour Top: 112.64,27.39 111.67,27.39 111.67,30.36 120.44,30.36 120.54,30.36 120.54,28.86 112.64,28.86
LASER_ON
  Bottom 0.254: PCB1.P$29 42.49,37.85 U5.1
LED1
  Top 0.61: PCB1.P$26 35.06,40.8 R12.2
LED2
  Top 0.61: PCB1.P$24 35.06,43.34 R13.2
LED3
  Top 0.61: PCB1.P$22 35.06,45.88 R14.2
LED_ON
  Bottom 0.254: U4.1 61.5,33.18 PCB1.P$31
MISO
  Top 0.305: J2.5 36.77,29.29 37.1,29.29 37.08,29.29 39.15,29.29 PCB1.P$35
  Bottom 0.406: U2.7 32.61,25.24 36.74,29.37 39.07,29.37 PCB1.P$35
MOSI  (via drill 0.6)
  Top 0.254: v29.51,23.3 35.55,23.3 PCB1.P$38
  Top 0.305: J2.4 37.81,25.77 PCB1.P$38
  Bottom 0.254: U2.10 29.49,23.29 v29.51,23.3
N$2
  Top 0.305: LED5.A R1.1
N$3
  Top 0.406: LED4.A 103.9,14.22 R2.1
N$4
  Top 0.305: LED1.A R5.1
N$5
  Top 0.305: LED2.A R4.1
N$6
  Top 0.61: R3.1 101.64,17.53 arc45 LED3.A
N$7
  Bottom 0.406: U2.12 26.2,19.25 R6.2
N$8
  Bottom 0.406: U2.19 15.82,25.89 R7.1
N$9
  Bottom 0.406: U2.4 24.45,27.19 23.79,27.85 23.79,32.08 C5.1
N$10
  Bottom 0.406: U2.5 28.83,26.54 29.12,26.83 29.12,27.85 29.38,28.1 R9.2
N$12
  Bottom 0.406: U2.6 29.62,25.89 R10.2
N$13
  Top 0.61: R12.1 LED6.A
N$14
  Top 0.61: R13.1 LED7.A
N$15
  Top 0.61: R14.1 LED8.A
N$18
  Bottom 1.016: U7.3 104.84,37.68 104.41,38.11 104.41,41.28 105.05,41.92 105.59,41.92 C4.1
N$19
  Bottom 1.016: C4.2 107.34,41.02 U7.1
  pour Bottom (rank 5, no thermals): 106.85,40.55 106.85,43.09 104.31,43.06 104.28,51.54 116.25,51.47 116.25,40.55
RESET
  Bottom 0.305: PCB1.P$7 53.44,63.66 U$3.RST
RX
  Bottom 0.254: U$1.R0 20.92,44.23 PCB1.P$10
RX_BT  (via drill 0.6)
  Top 0.305: v14.16,29.55 14.09,29.62 U$4.GND_PIEZO_1
  Bottom 0.305: J2.3 v14.16,29.55
  Bottom 0.406: U2.21 11.5,27.19 9.06,29.62 U$4.GND_PIEZO_1
RX_H
  Bottom 0.254: U$4.SCL_DIFF_L 5.63,40.42 U$1.Z
RX_L
  Bottom 0.254: U$4.28 6.9,39.15 U$1.Y
SCL
  Bottom 0.254: 53.44,66.2 U$3.SCL | J1.2 18.74,52.71 | 12.03,48.42 U$7.4 | 10.76,48.42 U$7.4 | U$7.4
  Bottom 0.406: U$4.39 3.75,51.27 7.56,51.27 10.32,48.43 10.56,48.43 10.76,48.42 | PCB1.P$5 39.08,64.93 33.7,64.93 20.69,51.93 19.52,51.93 | PCB1.P$5 53.44,66.2 | R8.1 41.65,67.5 PCB1.P$5 | 18.74,52.71 19.52,51.93 | 19.52,51.93 19.52,50.76 17.19,48.42 16.55,48.42 16.35,48.7 15.59,48.7 15.39,48.43 12.41,48.43 12.03,48.42
SCLK
  Bottom 0.406: U2.8 36.24,24.59 PCB1.P$40
SDA
  Bottom 0.254: 10.67,49.43 U$7.2 12.08,49.44 | 53.44,68.74 U$3.SDA | 16.89,50.92 J1.3
  Bottom 0.305: 40.35,68.84 PCB1.P$3
  Bottom 0.406: 10.67,49.43 7.61,52.48 7.61,53.09 arc90 6.16,54.47 arc90 4.99,53.22 U$4.SDA | 53.44,68.74 PCB1.P$3 39.18,67.47 30.7,67.5 15.99,52.59 15.99,51.82 | R11.1 41.6,69.99 40.35,68.84 | 15.99,51.82 15.23,51.82 12.84,49.43 12.08,49.43 12.08,49.44 | 15.99,51.82 16.89,50.92
SERVO_PWM  (via drill 0.6)
  Top 0.254: v30.9,58.56 30.92,58.58 PCB1.P$12
  Bottom 0.254: U$4.33 3.75,46.16 8.5,46.16 9.11,46.77 18.79,46.77 30.57,58.56 v30.9,58.56
TX  (via drill 0.6)
  Top 0.254: v17.97,40.78 v17.97,45.65
  Bottom 0.254: U$1.DI 17.62,40.42 v17.97,40.78 | v17.97,45.65 19.8,45.65 PCB1.P$8
TX_BT
  Bottom 0.305: J2.2 20.21,38.21
  Bottom 0.406: U2.22 12.12,27.84 7.79,32.16 | 7.79,32.16 U$4.24 | 20.21,38.21 14.16,32.16 7.79,32.16
TX_H
  Bottom 0.254: U$1.A 6.9,42.96 U$4.SDA_DIFF_L
TX_L
  Bottom 0.254: U$1.B 5.63,41.69 U$4.SCL_DIFF_H

### Text on the board
tPlace: rx bt | SCL | gnd | SDA | scl | sda | gnd | tx bt | 3 | mosi | miso | 2 | 1 | here | 5V | PIEZO | LASER | 5V OUT | CAM LED | GND | BT LED | 12V ON | 12V IN | GND | Made by: / Jason King, / James Scholl, / Ryan McBee, and / Luke McBee | /home/ryan/Downloads/snorlax.bmp
bPlace: SDA PULLUP | SCL PULLUP | LASER | CAM LED | BT LED